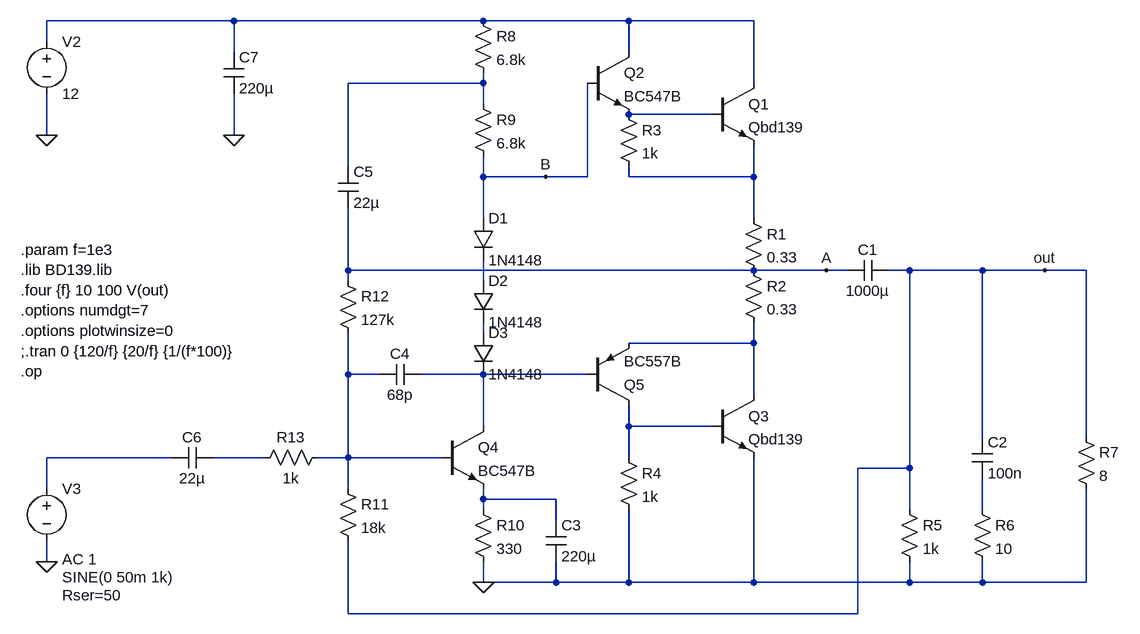
[diagram p0: schematic sound-au_project178.asc]
sound-au_project178.asc, the LTspice schematic file:
Version 4
SHEET 1 880 680
WIRE -496 -272 -784 -272
WIRE -112 -272 -496 -272
WIRE 112 -272 -112 -272
WIRE 304 -272 112 -272
WIRE -784 -240 -784 -272
WIRE -496 -224 -496 -272
WIRE 112 -224 112 -272
WIRE -112 -176 -112 -192
WIRE -112 -176 -320 -176
WIRE 304 -176 304 -272
WIRE -112 -144 -112 -176
WIRE 240 -128 112 -128
WIRE -784 -96 -784 -160
WIRE -496 -96 -496 -160
WIRE -320 -48 -320 -176
WIRE -112 -32 -112 -64
WIRE -16 -32 -112 -32
WIRE 48 -32 48 -176
WIRE 48 -32 -16 -32
WIRE 112 -32 112 -48
WIRE 304 -32 304 -80
WIRE 304 -32 112 -32
WIRE -112 32 -112 -32
WIRE 304 32 304 -32
WIRE -320 112 -320 16
WIRE 304 112 -320 112
WIRE 416 112 304 112
WIRE 448 112 416 112
WIRE 544 112 512 112
WIRE 656 112 544 112
WIRE 752 112 656 112
WIRE 816 112 752 112
WIRE -320 128 -320 112
WIRE -112 128 -112 96
WIRE -112 208 -112 192
WIRE 304 224 304 192
WIRE 304 224 112 224
WIRE -320 272 -320 208
WIRE -272 272 -320 272
WIRE -112 272 -208 272
WIRE 48 272 -112 272
WIRE 304 304 304 224
WIRE -112 352 -112 272
WIRE 112 352 112 320
WIRE 240 352 112 352
WIRE 656 368 656 112
WIRE 816 368 816 112
WIRE -592 400 -784 400
WIRE -448 400 -528 400
WIRE -320 400 -320 272
WIRE -320 400 -368 400
WIRE -176 400 -320 400
WIRE 112 400 112 352
WIRE 544 416 544 112
WIRE 544 416 464 416
WIRE -784 448 -784 400
WIRE -320 448 -320 400
WIRE -112 464 -112 448
WIRE 0 464 -112 464
WIRE -112 480 -112 464
WIRE 544 480 544 416
WIRE 656 480 656 432
WIRE 0 496 0 464
WIRE -784 560 -784 528
WIRE -112 592 -112 560
WIRE 0 592 0 560
WIRE 0 592 -112 592
WIRE 112 592 112 480
WIRE 112 592 0 592
WIRE 304 592 304 400
WIRE 304 592 112 592
WIRE 544 592 544 560
WIRE 544 592 304 592
WIRE 656 592 656 560
WIRE 656 592 544 592
WIRE 816 592 816 448
WIRE 816 592 656 592
WIRE -320 640 -320 528
WIRE 464 640 464 416
WIRE 464 640 -320 640
FLAG -784 560 0
FLAG -784 -96 0
FLAG 416 112 A
FLAG -112 592 0
FLAG 752 112 out
FLAG -496 -96 0
FLAG -16 -32 B
SYMBOL npn 240 -176 R0
SYMATTR InstName Q1
SYMATTR Value Qbd139
SYMBOL npn 48 -224 R0
SYMATTR InstName Q2
SYMATTR Value BC547B
SYMBOL npn 240 304 R0
SYMATTR InstName Q3
SYMATTR Value Qbd139
SYMBOL npn -176 352 R0
SYMATTR InstName Q4
SYMATTR Value BC547B
SYMBOL pnp 48 320 M180
SYMATTR InstName Q5
SYMATTR Value BC557B
SYMBOL res 288 16 R0
SYMATTR InstName R1
SYMATTR Value 0.33
SYMBOL res 288 96 R0
SYMATTR InstName R2
SYMATTR Value 0.33
SYMBOL res 96 -144 R0
SYMATTR InstName R3
SYMATTR Value 1k
SYMBOL res 96 384 R0
SYMATTR InstName R4
SYMATTR Value 1k
SYMBOL cap 512 96 R90
WINDOW 0 0 32 VBottom 2
WINDOW 3 32 32 VTop 2
SYMATTR InstName C1
SYMATTR Value 1000µ
SYMBOL res 528 464 R0
SYMATTR InstName R5
SYMATTR Value 1k
SYMBOL res 640 464 R0
SYMATTR InstName R6
SYMATTR Value 10
SYMBOL cap 640 368 R0
SYMATTR InstName C2
SYMATTR Value 100n
SYMBOL res 800 352 R0
SYMATTR InstName R7
SYMATTR Value 8
SYMBOL res -128 -288 R0
SYMATTR InstName R8
SYMATTR Value 6.8k
SYMBOL res -128 -160 R0
SYMATTR InstName R9
SYMATTR Value 6.8k
SYMBOL diode -128 32 R0
SYMATTR InstName D1
SYMATTR Value 1N4148
SYMBOL diode -128 128 R0
SYMATTR InstName D2
SYMATTR Value 1N4148
SYMBOL diode -128 208 R0
SYMATTR InstName D3
SYMATTR Value 1N4148
SYMBOL res -128 464 R0
SYMATTR InstName R10
SYMATTR Value 330
SYMBOL cap -16 496 R0
SYMATTR InstName C3
SYMATTR Value 220µ
SYMBOL cap -208 256 R90
WINDOW 0 0 32 VBottom 2
WINDOW 3 32 32 VTop 2
SYMATTR InstName C4
SYMATTR Value 68p
SYMBOL res -336 432 R0
SYMATTR InstName R11
SYMATTR Value 18k
SYMBOL res -336 112 R0
SYMATTR InstName R12
SYMATTR Value 127k
SYMBOL cap -336 -48 R0
SYMATTR InstName C5
SYMATTR Value 22µ
SYMBOL res -352 384 R90
WINDOW 0 0 56 VBottom 2
WINDOW 3 32 56 VTop 2
SYMATTR InstName R13
SYMATTR Value 1k
SYMBOL cap -528 384 R90
WINDOW 0 0 32 VBottom 2
WINDOW 3 32 32 VTop 2
SYMATTR InstName C6
SYMATTR Value 22µ
SYMBOL voltage -784 -256 R0
SYMATTR InstName V2
SYMATTR Value 12
SYMBOL voltage -784 432 R0
WINDOW 3 24 152 Left 2
WINDOW 123 24 124 Left 2
WINDOW 39 24 180 Left 2
SYMATTR Value SINE(0 50m 1k)
SYMATTR Value2 AC 1
SYMATTR SpiceLine Rser=50
SYMATTR InstName V3
SYMBOL cap -512 -224 R0
SYMATTR InstName C7
SYMATTR Value 220µ
TEXT -824 80 Left 2 !.param f=1e3\n.lib BD139.lib\n.four {f} 10 100 V(out)\n.options numdgt=7\n.options plotwinsize=0\n;.tran 0 {120/f} {20/f} {1/(f*100)}\n.op

The netlist it stands for:
* sound-au_project178.asc
Q1 N001 N003 N004 0 Qbd139
Q2 N001 B N003 0 BC547B
Q3 N007 N010 0 0 Qbd139
Q4 N009 N008 N013 0 BC547B
Q5 N010 N009 N007 0 BC557B
R1 N004 A 0.33
R2 A N007 0.33
R3 N003 N004 1k
R4 N010 0 1k
C1 out A 1000µ
R5 out 0 1k
R6 N014 0 10
C2 out N014 100n
R7 out 0 8
R8 N001 N002 6.8k
R9 N002 B 6.8k
D1 B N005 1N4148
D2 N005 N006 1N4148
D3 N006 N009 1N4148
R10 N013 0 330
C3 N013 0 220µ
C4 N009 N008 68p
R11 N008 out 18k
R12 A N008 127k
C5 N002 A 22µ
R13 N008 N012 1k
C6 N012 N011 22µ
V2 N001 0 12
V3 N011 0 SINE(0 50m 1k) AC 1 Rser=50
C7 N001 0 220µ
.model D D
.lib standard.dio
.model NPN NPN
.model PNP PNP
.lib standard.bjt
.param f=1e3
.lib BD139.lib
.four {f} 10 100 V(out)
.options numdgt=7
.options plotwinsize=0
;.tran 0 {120/f} {20/f} {1/(f*100)}
.op
.backanno
.end